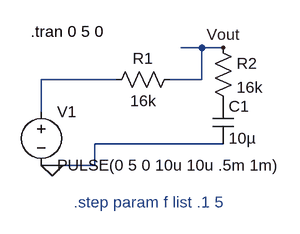
[diagram p0: schematic LPF passive  RC filter.asc]
LPF passive  RC filter.asc, the LTspice schematic file:
Version 4
SHEET 1 880 680
WIRE 224 48 192 48
WIRE 256 48 224 48
WIRE 96 96 -16 96
WIRE 224 96 224 48
WIRE 224 96 176 96
WIRE -16 144 -16 96
WIRE 256 192 64 192
WIRE 0 224 -16 224
WIRE 64 224 64 192
WIRE 64 224 0 224
FLAG 0 224 0
FLAG 256 48 Vout
SYMBOL res 80 112 R270
WINDOW 0 32 56 VTop 2
WINDOW 3 0 56 VBottom 2
SYMATTR InstName R1
SYMATTR Value 16k
SYMBOL voltage -16 128 R0
WINDOW 123 0 0 Left 0
WINDOW 39 0 0 Left 0
SYMATTR InstName V1
SYMATTR Value PULSE(0 5 0 10u 10u .5m 1m)
SYMBOL cap 240 128 R0
SYMATTR InstName C1
SYMATTR Value 10µ
SYMBOL res 240 32 R0
SYMATTR InstName R2
SYMATTR Value 16k
TEXT -32 24 Left 2 !.tran 0 5 0
TEXT 32 280 Left 2 ;.step param f list .1 5

The netlist it stands for:
* LPF passive  RC filter.asc
R1 N001 Vout 16k
V1 N001 0 PULSE(0 5 0 10u 10u .5m 1m)
C1 P001 0 10µ
R2 Vout P001 16k
.tran 0 5 0
* .step param f list .1 5
.backanno
.end